# EAGLE design Analog_sensor_revA (EAGLE 8.5.0)
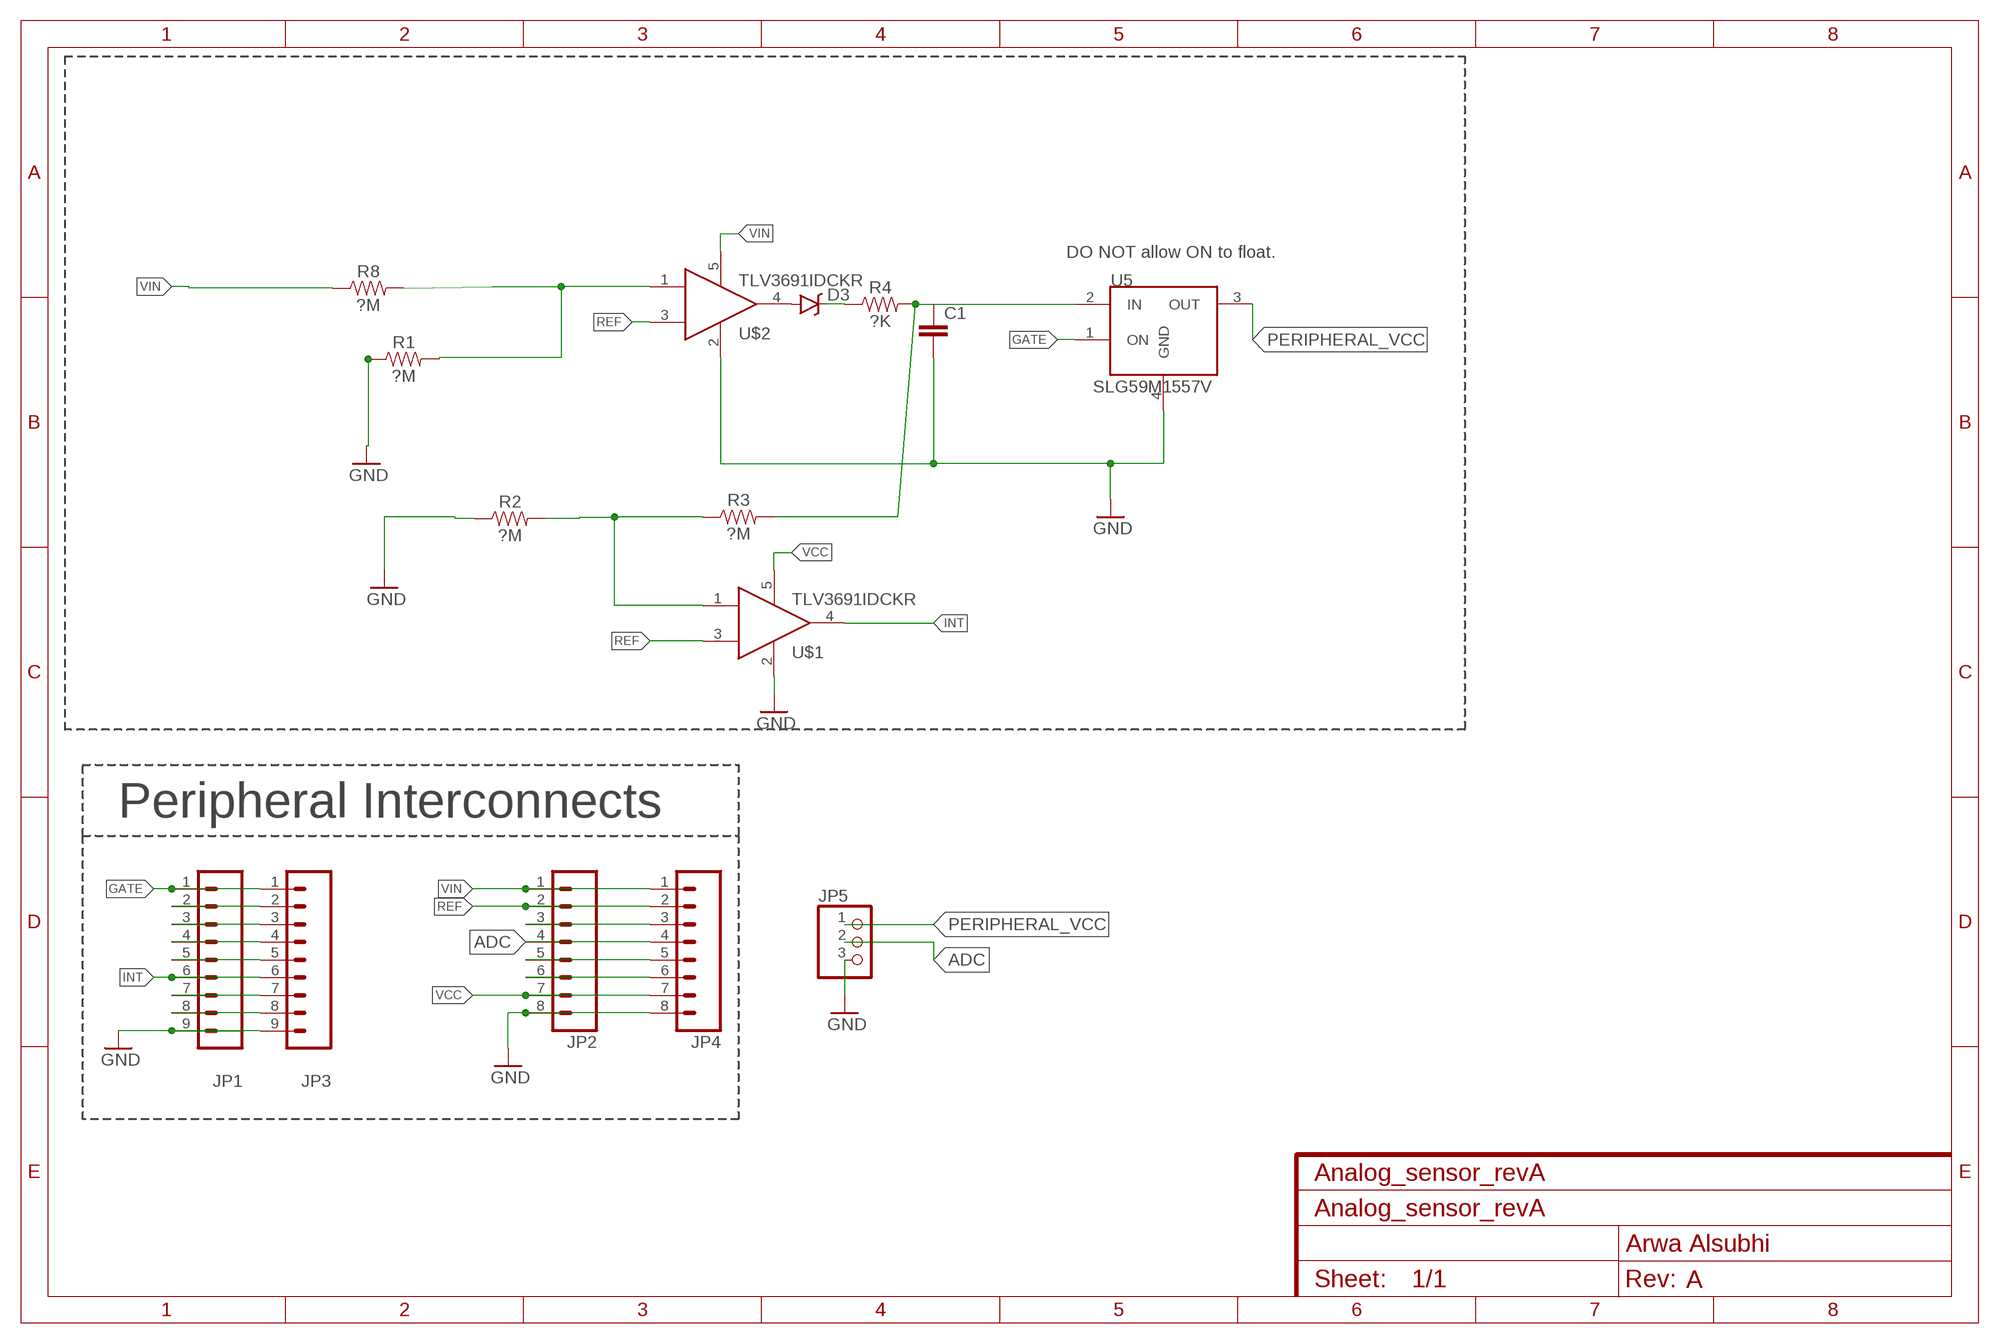
[diagram p0: schematic, sheet 1]
FRAME2 (FRAME-A4L): CNAME: Analog_sensor_revA; CREVISION: A; DESIGNER: Arwa Alsubhi

## Parts
C1  CAP0603-CAP  [0603-CAP]
D3  RB751  DIODE-SCHOTTKY-RB751  [SOD-523]
JP1  M091.27MM  [1X09-1.27MM]
JP2  M081.27MM  [1X08-1.27MM]
JP3  M091.27MM  [1X09-1.27MM]
JP4  M081.27MM  [1X08-1.27MM]
JP5  PINHD-1X3  [1X03]
R1  ?M  0.3OHM-0805-1/8W-1%  [0805]
R2  ?M  0.3OHM-0805-1/8W-1%  [0805]
R3  ?M  0.3OHM-0805-1/8W-1%  [0805]
R4  ?K  0.3OHM-0805-1/8W-1%  [0805]
R8  ?M  0.3OHM-0805-1/8W-1%  [0805]
U5  SLG59M1557V  [4STDFN]
U$1  TLV3691IDCKR  [SOT353]
U$2  TLV3691IDCKR  [SOT353]

## Nets
ADC: JP2.4 JP4.4 JP5.2
GATE: JP1.1 JP3.1 U5.1(ON)
GND: C1.2 JP1.9 JP2.8 JP3.9 JP4.8 JP5.3 R1.1 R2.1 U5.4(GND) U$1.2 U$2.2
INT: JP1.6 JP3.6 U$1.4
N$1: D3.A U$2.4
N$2: JP1.4 JP3.4
N$3: JP1.2 JP3.2
N$4: R1.2 R8.2 U$2.1
N$5: R2.2 R3.1 U$1.1
N$6: JP1.5 JP3.5
N$7: JP1.7 JP3.7
N$8: JP1.8 JP3.8
N$9: JP2.3 JP4.3
N$10: JP2.5 JP4.5
N$11: JP2.6 JP4.6
N$13: JP1.3 JP3.3
N$15: D3.C R4.1
N$20: C1.1 R3.2 R4.2 U5.2(IN)
PERIPHERAL_VCC: JP5.1 U5.3(OUT)
REF: JP2.2 JP4.2 U$1.3 U$2.3
VCC: JP2.7 JP4.7 U$1.5
VIN: JP2.1 JP4.1 R8.1 U$2.5

## Notes on the sheet
- DO NOT allow ON to float.
- Peripheral Interconnects

## Library data of the parts
C1 = SparkFun-Capacitors:CAP: Capacitor Standard 0603 ceramic capacitor, and 0.1" leaded capacitor.
D3 = SparkFun-DiscreteSemi:DIODE-SCHOTTKY: Schottky diodes in SFE's production catalog BAT20J 1A 23V 0.62Vf RB751 120mA 40V 0.37Vf PMEG4005EJ 0.5A 40V 0.42Vf MBRA140 1A 40V 0.5Vf B340A 3A 40V SMA; DIGIKEY: BAS40-02V-V-G-08GICT-ND; MPN: BAS40-02V-V-G-08; PROD_ID: DIO-11018
JP1 JP3 = SparkFun-Connectors:M09: Header 9 Standard 9-pin 0.1" header. Use with straight break away headers (SKU : PRT-00116), right angle break away headers (PRT-00553), swiss pins (PRT-00743), machine pins (PRT-00117), and female headers (PRT-00115).; DIGIKEY: S9014E-09-ND; MANUFACTURERPARTNUMBER: GRPB091VWVN-RC; MPN: GRPB091VWVN-RC
JP2 JP4 = SparkFun-Connectors:M08: Header 8 Standard 8-pin 0.1" header. Use with straight break away headers (SKU : PRT-00116), right angle break away headers (PRT-00553), swiss pins (PRT-00743), machine pins (PRT-00117), and female headers (PRT-00115).; DIGIKEY: S9014E-08-ND; MANUFACTURERPARTNUMBER: GRPB081VWVN-RC; MPN: GRPB081VWVN-RC
JP5 = pinhead:PINHD-1X3: PIN HEADER
R1-R4 R8 = SparkFun-Resistors:0.3OHM: 0.3Ω resistor A resistor is a passive two-terminal electrical component that implements electrical resistance as a circuit element. Resistors act to reduce current flow, and, at the same time, act to lower voltage levels within circuits. - Wikipedia; PROD_ID: RES-11622; VALUE: 0.3
U5 = loadswitches:SLG59M1557V: SILEGO SLG59M1557V: Ultra-small 28.5 mΩ, 1.0 A Integrated Power Switch with Discharge The SLG59M1557V is designed for load switching applications with ultra low quiescent current (20nA), and low turn on voltage (0.85V). The part comes with one 28.5 mΩ 1.0 A rated P-channel MOSFET controlled by a single ON control pin. The product is packaged in an ultra-small 1.0 x 1.0 mm package.; MANAFACTURER: SLG59M1557V; MOUSER: 402-SLG59M1557V; MPN: SLG59M1557V
U$1 U$2 = Arwa_lib:TLV3691IDCKR

## Board
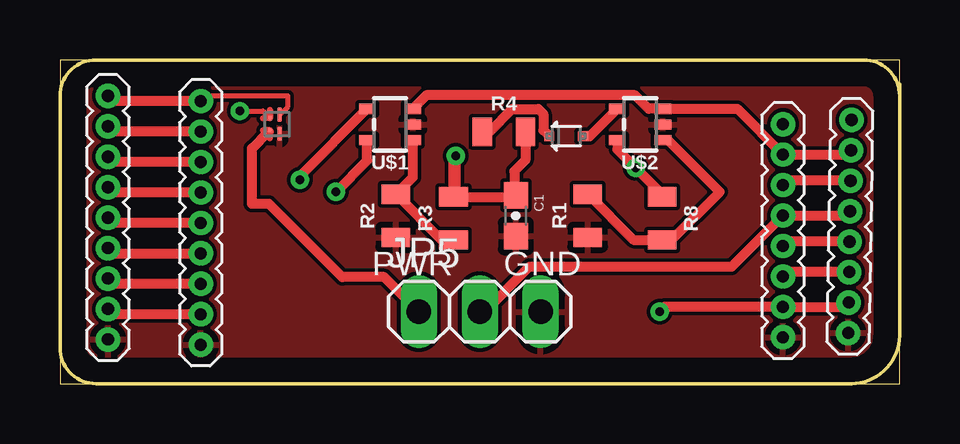
[diagram p1: board, top side]
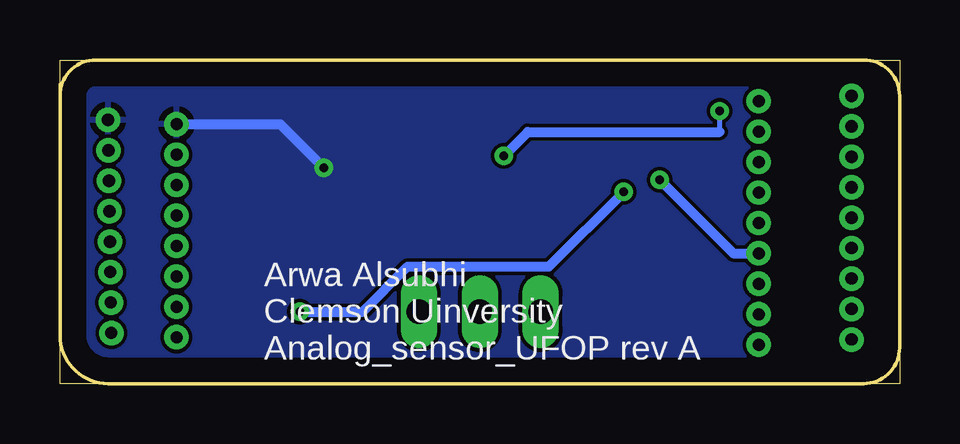
[diagram p2: board, bottom side, seen from below]

Size 35 x 13.5 mm. Coordinates in mm from the lower left corner, seen from the top.
Outline: 1.5,0 0,0 0,13.5 33.5,13.5
Outline: 1.5,0 35,0 35,2
Outline: 35,2 35,12
Outline: 35,12 35,12.5
Outline: 35,12.5 35,13.5 33.5,13.5
Outline: 35,12 arc90 33.5,13.5
Outline: 33.5,13.5 1.5,13.5 arc90 0,12 0,1.5 arc90 1.5,0
Outline: 1.5,0 33,0 arc90 35,2
Outline: 35,2 35,12.5
Copper layers (1*16): Top 0.035mm / dielectric 1.5mm / Bottom 0.035mm
Design rules "default": minimum track width 6mil, minimum drill 0.35mm, track to track 6mil, track to pad 6mil, pad to pad 6mil, via to via 6mil, smd to smd 6mil, copper to edge 40mil, drill to drill 6mil, minimum pad ring 10mil, minimum via ring 8mil, stop-mask expansion 4mil, vias tented up to drill 0mil, thermal gap 10mil

### Footprints (pad centres in the part's own frame; a part is rotated, then mirrored left to right if it is on the bottom)
0603-CAP = smd 1.1 x 1: 1 -0.85,0; 2 0.85,0
SOD-523 = smd 0.4 x 0.4: A -0.7,0; C 0.7,0
1X09-1.27MM = drill 0.508 pad 1: 1 0,0; 2 1.27,0; 3 2.54,0; 4 3.81,0; 5 5.08,0; 6 6.35,0; 7 7.62,0; 8 8.89,0; 9 10.16,0
1X08-1.27MM = drill 0.508 pad 1: 1 0,0; 2 1.27,0; 3 2.54,0; 4 3.81,0; 5 5.08,0; 6 6.35,0; 7 7.62,0; 8 8.89,0
1X03 = drill 1.016 long: 1 -2.54,0; 2 0,0; 3 2.54,0
0805 = smd 0.8 x 1.2: 1 -0.9,0; 2 0.9,0
4STDFN = smd 0.6 x 0.2: 1 -0.4,0.1; 4 0.4,0.1 | smd 0.152 x 0.152: 2 -0.25,-0.3; 3 0.25,-0.3
SOT353 = smd 0.42 x 0.7: 1 -0.65,-0.95; 2 0,-0.95; 3 0.65,-0.95; 4 0.65,0.95; 5 -0.65,0.95

### Placement (x,y rotation side)
C1  19,7 270 top
D3  21.1,10.32 180 top
JP1  5.87,11.78 270 top
JP2  30.14,10.82 270 top
JP3  2,12 270 top
JP4  33,11 269.1 top
JP5  17.5,3 0 top
R1  22,7 90 top
R2  14,7 90 top
R3  16.41,6.89 90 top
R4  18.5,10.5 0 top
R8  25.1,6.89 270 top
U5  9.06,10.82 270 top
U$1  13.76,10.81 90 top
U$2  24.18,10.81 90 top

### Tracks (layer width: path | path; a pad name or v marks a point on that pad's centre or on a via)
ADC
  Top 0.406: JP5.2 17.7,3 19.58,4.88 28.01,4.88 JP2.4 32.76,7.01 JP4.4
GATE
  Top 0.203: U5.1 9.5,11.56 9.5,12 6.09,12 JP1.1
  Top 0.406: JP1.1 2.22,11.78 JP3.1
GND
  pour Top: 1,13.5 34,13.5 arc-90 35,12.5 35,1.5 arc-90 33.5,0 1,0 arc-90 0,1 0,12.5 arc-90
INT  (via drill 0.35)
  Top 0.406: JP3.6 2.22,5.43 JP1.6 | U$1.4 10,8.65 v10,8.5
  Bottom 0.406: v10,8.5 6.93,5.43 JP1.6
N$1
  Top 0.406: U$2.4 22.09,10.32 D3.A
N$2
  Top 0.406: JP1.4 2.22,7.97 JP3.4
N$3
  Top 0.406: JP1.2 2.22,10.51 JP3.2
N$4
  Top 0.406: R1.2 23.91,5.99 R8.2 25.49,5.99 27.5,8 25.34,10.16 U$2.1
N$5
  Top 0.406: R3.1 15.91,5.99 R2.2 14.71,8.61 U$1.1
N$6
  Top 0.406: JP1.5 2.22,6.7 JP3.5
N$7
  Top 0.406: JP1.7 2.22,4.16 JP3.7
N$8
  Top 0.406: JP1.8 2.22,2.89 JP3.8
N$9
  Top 0.406: JP4.3 30.32,8.46 JP2.3
N$10
  Top 0.406: JP4.5 30.32,5.92 JP2.5
N$11
  Top 0.406: JP4.6 30.32,4.65 JP2.6
N$13
  Top 0.406: JP1.3 2.22,9.24 JP3.3
N$15
  Top 0.406: R4.1 17.9,10.5 18.85,11.46 19.95,11.46 20.16,11.25 20.16,10.56 D3.C
N$20  (via drill 0.35)
  Top 0.203: v7.5,11.37 8.46,11.37 U5.2
  Top 0.406: 18.94,7.79 18.94,8.86 19.4,9.32 R4.2 | 16.5,7.88 v16.5,9.5 16.41,9.41 R3.2 18.94,7.79 | 18.94,7.79 C1.1
  Bottom 0.203: 7.5,10.5 v7.5,11.37
  Bottom 0.406: v16.5,9.5 15.5,10.5 7.5,10.5
PERIPHERAL_VCC
  Top 0.203: 8.7,10.51 U5.3
  Top 0.406: JP5.1 13.52,4.44 11.77,4.44 8.71,7.5 8,7.5 8,9.81 8.7,10.51
REF
  Top 0.406: JP4.2 32.8,9.55 JP2.2 28.23,11.46 U$2.3 24.54,11.46 23.97,12.03 15.28,12.03 U$1.3
VCC  (via drill 0.35)
  Top 0.406: JP4.7 32.7,3.2 JP2.7 25.2,3.2 v25,3 | v11.5,8 12.81,9.31 U$1.5
  Bottom 0.406: v11.5,8 14.62,4.88 20.5,4.88 22.38,3 v25,3
VIN  (via drill 0.35)
  Top 0.406: U$2.5 23.23,9.77 v24,9 25.1,7.9 R8.1
  Bottom 0.406: JP2.1 25.82,10.82 v24,9
  pour Bottom: 1.5,13.5 33.5,13.5 arc-90 35,12 35,2.5 arc-90 32.5,0 2.5,0 arc-90 0,2.5 0,12 arc-90

### Text on the board
tNames: PWR | GND
bNames: Arwa Alsubhi / Clemson Uinversity / Analog_sensor_UFOP rev A